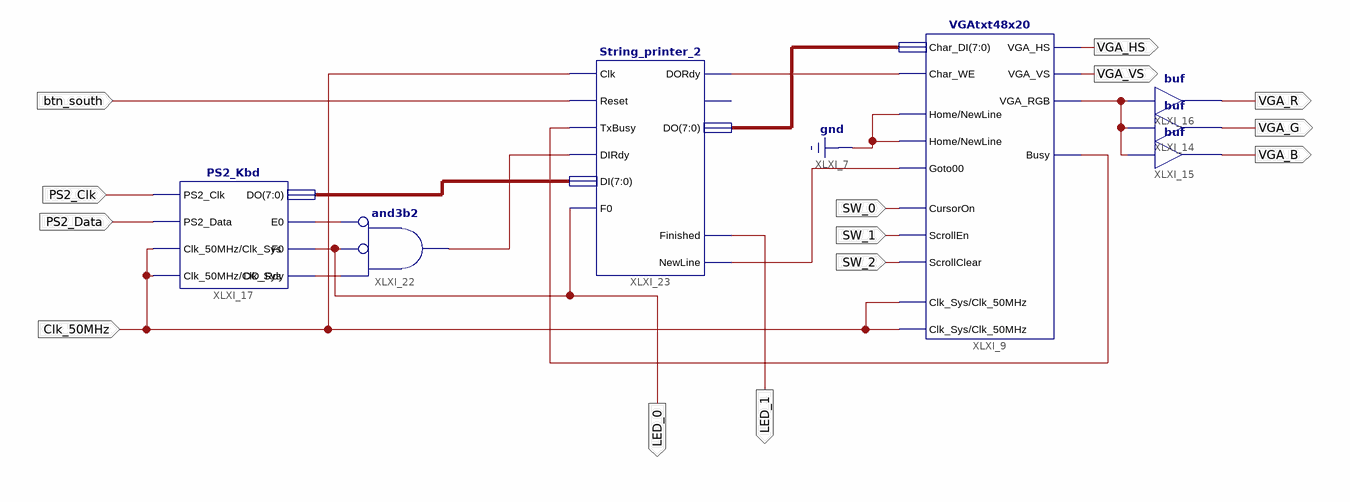
[diagram p0: schematic sheet 1]
// Xilinx ISE schematic test1.sch (spartan3e) as structural Verilog: 7 symbols, 14 ports
module test1 (
  input  SW_0,
  input  SW_1,
  input  SW_2,
  input  Clk_50MHz,
  input  btn_south,
  input  PS2_Clk,
  input  PS2_Data,
  output VGA_HS,
  output VGA_VS,
  output VGA_B,
  output VGA_G,
  output VGA_R,
  output LED_0,
  output LED_1
);

  wire XLXN_21, XLXN_47, XLXN_52, XLXN_54, XLXN_57, XLXN_59, XLXN_68;
  wire [7:0] XLXN_2, XLXN_51;

  VGAtxt48x20 XLXI_9 (
    .Char_DI(XLXN_2), .Home(1'b0), .NewLine(1'b0), .Goto00(XLXN_68), .Clk_Sys(Clk_50MHz),
    .Clk_50MHz(Clk_50MHz), .CursorOn(SW_0), .ScrollEn(SW_1), .ScrollClear(SW_2), .Busy(XLXN_52),
    .VGA_HS(VGA_HS), .VGA_VS(VGA_VS), .VGA_RGB(XLXN_21), .Char_WE(XLXN_59));
  buf XLXI_14 (VGA_G, XLXN_21);
  buf XLXI_15 (VGA_B, XLXN_21);
  buf XLXI_16 (VGA_R, XLXN_21);
  PS2_Kbd XLXI_17 (
    .PS2_Clk(PS2_Clk), .PS2_Data(PS2_Data), .Clk_50MHz(Clk_50MHz), .E0(XLXN_47), .F0(LED_0),
    .DO_Rdy(XLXN_54), .DO(XLXN_51), .Clk_Sys(Clk_50MHz));
  and XLXI_22 (XLXN_57, ~XLXN_47, ~LED_0, XLXN_54);  // and3b2
  String_printer_2 XLXI_23 (
    .Clk(Clk_50MHz), .Reset(btn_south), .TxBusy(XLXN_52), .DIRdy(XLXN_57), .F0(LED_0), .DI(XLXN_51),
    .DORdy(XLXN_59), .Finished(LED_1), .NewLine(XLXN_68), .DO(XLXN_2));  // open: Busy
endmodule
